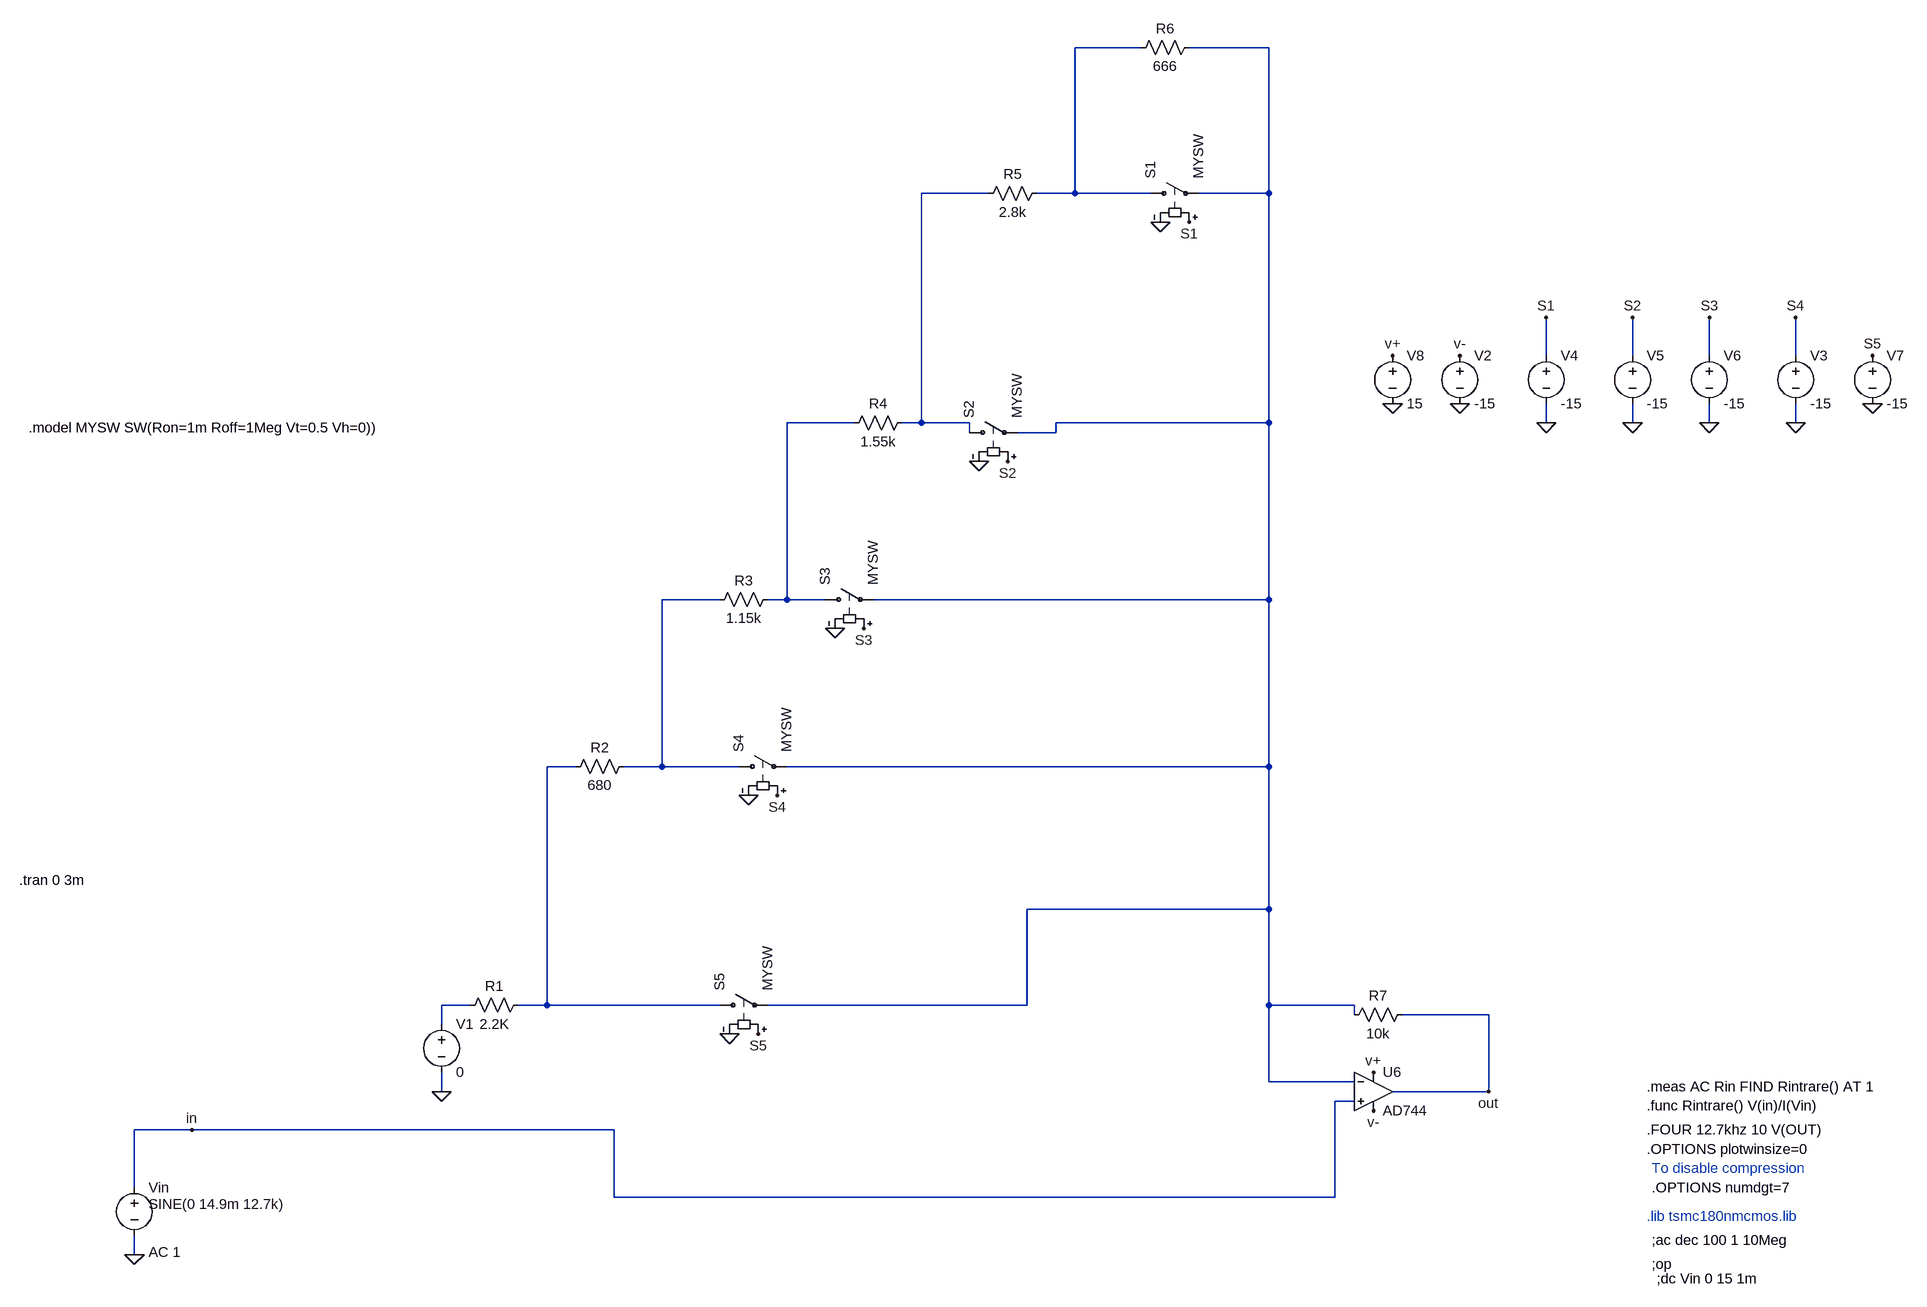
[diagram p0: schematic PGA.asc]
PGA.asc, the LTspice schematic file:
Version 4
SHEET 1 1820 1108
WIRE -560 -1504 -672 -1504
WIRE -160 -1504 -480 -1504
WIRE -816 -1216 -928 -1216
WIRE -672 -1216 -672 -1504
WIRE -672 -1216 -736 -1216
WIRE -544 -1216 -672 -1216
WIRE -160 -1216 -160 -1504
WIRE -160 -1216 -464 -1216
WIRE 352 -912 352 -976
WIRE 496 -912 496 -976
WIRE 624 -912 624 -976
WIRE 768 -912 768 -976
WIRE -1040 -800 -1152 -800
WIRE -928 -800 -928 -1216
WIRE -928 -800 -960 -800
WIRE -848 -800 -928 -800
WIRE -160 -800 -160 -1216
WIRE -160 -800 -704 -800
WIRE 352 -800 352 -832
WIRE 496 -800 496 -832
WIRE 624 -800 624 -832
WIRE 768 -800 768 -832
WIRE -848 -784 -848 -800
WIRE -704 -784 -704 -800
WIRE -704 -784 -768 -784
WIRE -1264 -384 -1360 -384
WIRE -1152 -384 -1152 -800
WIRE -1152 -384 -1184 -384
WIRE -1088 -384 -1152 -384
WIRE -160 -384 -160 -800
WIRE -160 -384 -1008 -384
WIRE -1504 16 -1552 16
WIRE -1360 16 -1360 -384
WIRE -1360 16 -1424 16
WIRE -1232 16 -1360 16
WIRE -160 16 -160 -384
WIRE -160 16 -1152 16
WIRE -160 272 -160 16
WIRE -160 272 -752 272
WIRE -1680 432 -1728 432
WIRE -1552 432 -1552 16
WIRE -1552 432 -1600 432
WIRE -1264 432 -1552 432
WIRE -752 432 -752 272
WIRE -752 432 -1184 432
WIRE -160 432 -160 272
WIRE 32 432 -160 432
WIRE 32 448 32 432
WIRE 256 448 112 448
WIRE -1728 464 -1728 432
WIRE -160 560 -160 432
WIRE 32 560 -160 560
WIRE -1728 576 -1728 544
WIRE 256 576 256 448
WIRE 256 576 96 576
WIRE 32 592 0 592
WIRE -2144 640 -2240 640
WIRE -1440 640 -2144 640
WIRE -2240 736 -2240 640
WIRE -1440 752 -1440 640
WIRE 0 752 0 592
WIRE 0 752 -1440 752
WIRE -2240 848 -2240 816
FLAG -2240 848 0
FLAG 352 -800 0
FLAG 352 -976 S1
FLAG 496 -800 0
FLAG 496 -976 S2
FLAG 624 -800 0
FLAG 624 -976 S3
FLAG 768 -800 0
FLAG 768 -976 S4
FLAG -1728 576 0
FLAG -2144 640 in
FLAG 896 -832 0
FLAG 896 -912 S5
FLAG 256 576 out
FLAG 96 -832 0
FLAG 208 -832 0
FLAG 96 -912 v+
FLAG 208 -912 v-
FLAG 64 544 v+
FLAG 64 608 v-
FLAG -1248 480 0
FLAG -1200 480 S5
FLAG -528 -1168 0
FLAG -832 -736 0
FLAG -1072 -336 0
FLAG -1216 64 0
FLAG -1168 64 S4
FLAG -1024 -336 S3
FLAG -784 -736 S2
FLAG -480 -1168 S1
SYMBOL voltage 208 -928 R0
WINDOW 123 0 0 Left 2
WINDOW 39 0 0 Left 2
SYMATTR InstName V2
SYMATTR Value -15
SYMBOL res -1584 416 R90
WINDOW 0 0 56 VBottom 2
WINDOW 3 32 56 VTop 2
SYMATTR InstName R1
SYMATTR Value 2.2K
SYMBOL voltage 352 -928 R0
WINDOW 123 0 0 Left 2
WINDOW 39 0 0 Left 2
SYMATTR InstName V4
SYMATTR Value -15
SYMBOL voltage 496 -928 R0
WINDOW 123 0 0 Left 2
WINDOW 39 0 0 Left 2
SYMATTR InstName V5
SYMATTR Value -15
SYMBOL voltage 624 -928 R0
WINDOW 123 0 0 Left 2
WINDOW 39 0 0 Left 2
SYMATTR InstName V6
SYMATTR Value -15
SYMBOL voltage -2240 720 R0
WINDOW 123 24 124 Left 2
WINDOW 39 0 0 Left 2
WINDOW 3 24 44 Left 2
SYMATTR Value2 AC 1
SYMATTR Value SINE(0 14.9m 12.7k)
SYMATTR InstName Vin
SYMBOL voltage 768 -928 R0
WINDOW 123 0 0 Left 2
WINDOW 39 0 0 Left 2
SYMATTR InstName V3
SYMATTR Value -15
SYMBOL voltage -1728 448 R0
WINDOW 123 0 0 Left 0
WINDOW 39 0 0 Left 0
SYMATTR InstName V1
SYMATTR Value 0
SYMBOL res -1408 0 R90
WINDOW 0 0 56 VBottom 2
WINDOW 3 32 56 VTop 2
SYMATTR InstName R2
SYMATTR Value 680
SYMBOL res -1168 -400 R90
WINDOW 0 0 56 VBottom 2
WINDOW 3 32 56 VTop 2
SYMATTR InstName R3
SYMATTR Value 1.15k
SYMBOL res -944 -816 R90
WINDOW 0 0 56 VBottom 2
WINDOW 3 32 56 VTop 2
SYMATTR InstName R4
SYMATTR Value 1.55k
SYMBOL res -720 -1232 R90
WINDOW 0 0 56 VBottom 2
WINDOW 3 32 56 VTop 2
SYMATTR InstName R5
SYMATTR Value 2.8k
SYMBOL res -464 -1520 R90
WINDOW 0 0 56 VBottom 2
WINDOW 3 32 56 VTop 2
SYMATTR InstName R6
SYMATTR Value 666
SYMBOL voltage 896 -928 R0
WINDOW 123 0 0 Left 0
WINDOW 39 0 0 Left 0
SYMATTR InstName V7
SYMATTR Value -15
SYMBOL OpAmps\\AD744 64 512 R0
SYMATTR InstName U6
SYMBOL res 128 432 R90
WINDOW 0 0 56 VBottom 2
WINDOW 3 32 56 VTop 2
SYMATTR InstName R7
SYMATTR Value 10k
SYMBOL voltage 96 -928 R0
WINDOW 123 0 0 Left 0
WINDOW 39 0 0 Left 0
SYMATTR InstName V8
SYMATTR Value 15
SYMBOL sw -560 -1216 R270
SYMATTR InstName S1
SYMATTR Value MYSW
SYMBOL sw -864 -784 R270
SYMATTR InstName S2
SYMATTR Value MYSW
SYMBOL sw -1104 -384 R270
SYMATTR InstName S3
SYMATTR Value MYSW
SYMBOL sw -1248 16 R270
SYMATTR InstName S4
SYMATTR Value MYSW
SYMBOL sw -1280 432 R270
SYMATTR InstName S5
SYMATTR Value MYSW
TEXT 528 824 Left 2 !;ac dec 100 1 10Meg
TEXT 528 864 Left 2 !;op
TEXT 520 784 Left 2 ;.lib tsmc180nmcmos.lib
TEXT 536 888 Left 2 !;dc Vin 0 15 1m
TEXT 520 568 Left 2 !.meas AC Rin FIND Rintrare() AT 1
TEXT 520 600 Left 2 !.func Rintrare() V(in)/I(Vin)
TEXT 520 640 Left 2 !.FOUR 12.7khz 10 V(OUT)
TEXT 520 672 Left 2 !.OPTIONS plotwinsize=0
TEXT 528 704 Left 2 ;To disable compression
TEXT 528 736 Left 2 !.OPTIONS numdgt=7
TEXT -2416 -792 Left 2 !.model MYSW SW(Ron=1m Roff=1Meg Vt=0.5 Vh=0))
TEXT -2432 224 Left 2 !.tran 0 3m

The netlist it stands for:
* PGA.asc
V2 v- 0 -15
R1 N006 N007 2.2K
V4 S1 0 -15
V5 S2 0 -15
V6 S3 0 -15
Vin in 0 SINE(0 14.9m 12.7k) AC 1
V3 S4 0 -15
V1 N007 0 0
R2 N005 N006 680
R3 N004 N005 1.15k
R4 N003 N004 1.55k
R5 N001 N003 2.8k
R6 N002 N001 666
V7 S5 0 -15
XU6 in N002 v+ v- out AD744  ; pins In+ In- V+ V- OUT
R7 out N002 10k
V8 v+ 0 15
S1 N001 N002 S1 0 MYSW
S2 N003 N002 S2 0 MYSW
S3 N004 N002 S3 0 MYSW
S4 N005 N002 S4 0 MYSW
S5 N006 N002 S5 0 MYSW
;ac dec 100 1 10Meg
;op
* .lib tsmc180nmcmos.lib
;dc Vin 0 15 1m
.meas AC Rin FIND Rintrare() AT 1
.func Rintrare() V(in)/I(Vin)
.FOUR 12.7khz 10 V(OUT)
.OPTIONS plotwinsize=0
* To disable compression
.OPTIONS numdgt=7
.model MYSW SW(Ron=1m Roff=1Meg Vt=0.5 Vh=0))
.tran 0 3m
.backanno
.end

* Results of the author's LTspice run, read from the files saved beside the schematic
* Operating Point, zero values left out:
*   V(v-) = -15 V
*   V(s1) = -15 V
*   V(s2) = -15 V
*   V(s3) = -15 V
*   V(s4) = -15 V
*   V(s5) = -15 V
*   V(v+) = 15 V
*   V(out) = 1.1 µV
*   I(R7) = 110 pA
*   I(V8) = -4.899 mA
*   I(Vin) = -110 pA
*   I(V2) = 4.899 mA
*   Ix(u6:1) = 110 pA
*   Ix(u6:2) = 110 pA
*   Ix(u6:3) = 4.899 mA
*   Ix(u6:4) = -4.899 mA
*   Ix(u6:5) = -110 pA
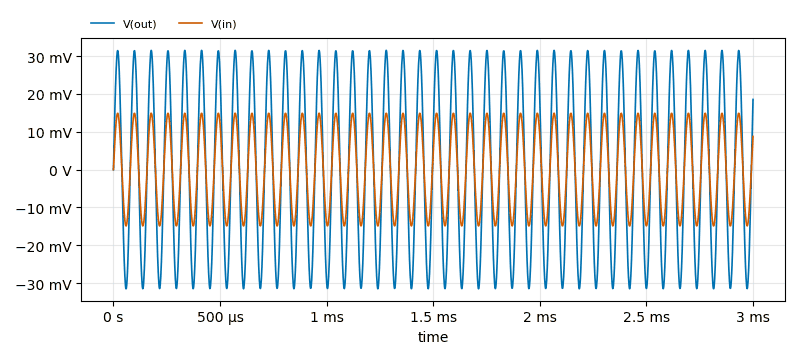
[diagram p1: Transient Analysis of PGA.asc, plotted from the saved traces]
* Transient Analysis, 1 run:
*   V(out): min -31.53 mV, max 31.53 mV, average 29.1 µV, rms 22.14 mV, last 18.55 mV
*   V(in): min -14.9 mV, max 14.9 mV, average 12.24 µV, rms 10.54 mV, last 8.758 mV
* From the log:
*   N-Period=1
*   Fourier components of V(out)
*   DC component:9.15446e-006
*   Harmonic  Frequency   Fourier   Normalized   Phase    Normalized
*    Number     [Hz]     Component   Component  [degree]  Phase [deg]
*       1     1.270e+04  3.118e-02  1.000e+00     -0.03°      0.00°
*       2     2.540e+04  3.434e-06  1.101e-04     -0.31°     -0.28°
*       3     3.810e+04  1.211e-04  3.884e-03   -178.83°   -178.80°
*       4     5.080e+04  1.630e-05  5.226e-04    -11.25°    -11.22°
*       5     6.350e+04  9.562e-05  3.066e-03     -3.21°     -3.18°
*       6     7.620e+04  1.213e-05  3.891e-04   -120.04°   -120.00°
*       7     8.890e+04  5.956e-05  1.910e-03   -166.35°   -166.32°
*       8     1.016e+05  1.069e-05  3.430e-04   -159.47°   -159.44°
*       9     1.143e+05  1.666e-05  5.341e-04     40.33°     40.36°
*      10     1.270e+05  8.404e-06  2.695e-04     97.54°     97.57°
*   Total Harmonic Distortion: 0.538953%(0.572531%)